# Altium schematic sheet output_driver.SchDoc: Output Drivers
size Letter; Organization: NewAE Technology Inc.; Address1: 1083 Queen St., Suite 196; Address2: Halifax; Address3: NS; Address4: Canada B3H 0B2; SheetApproved: NO
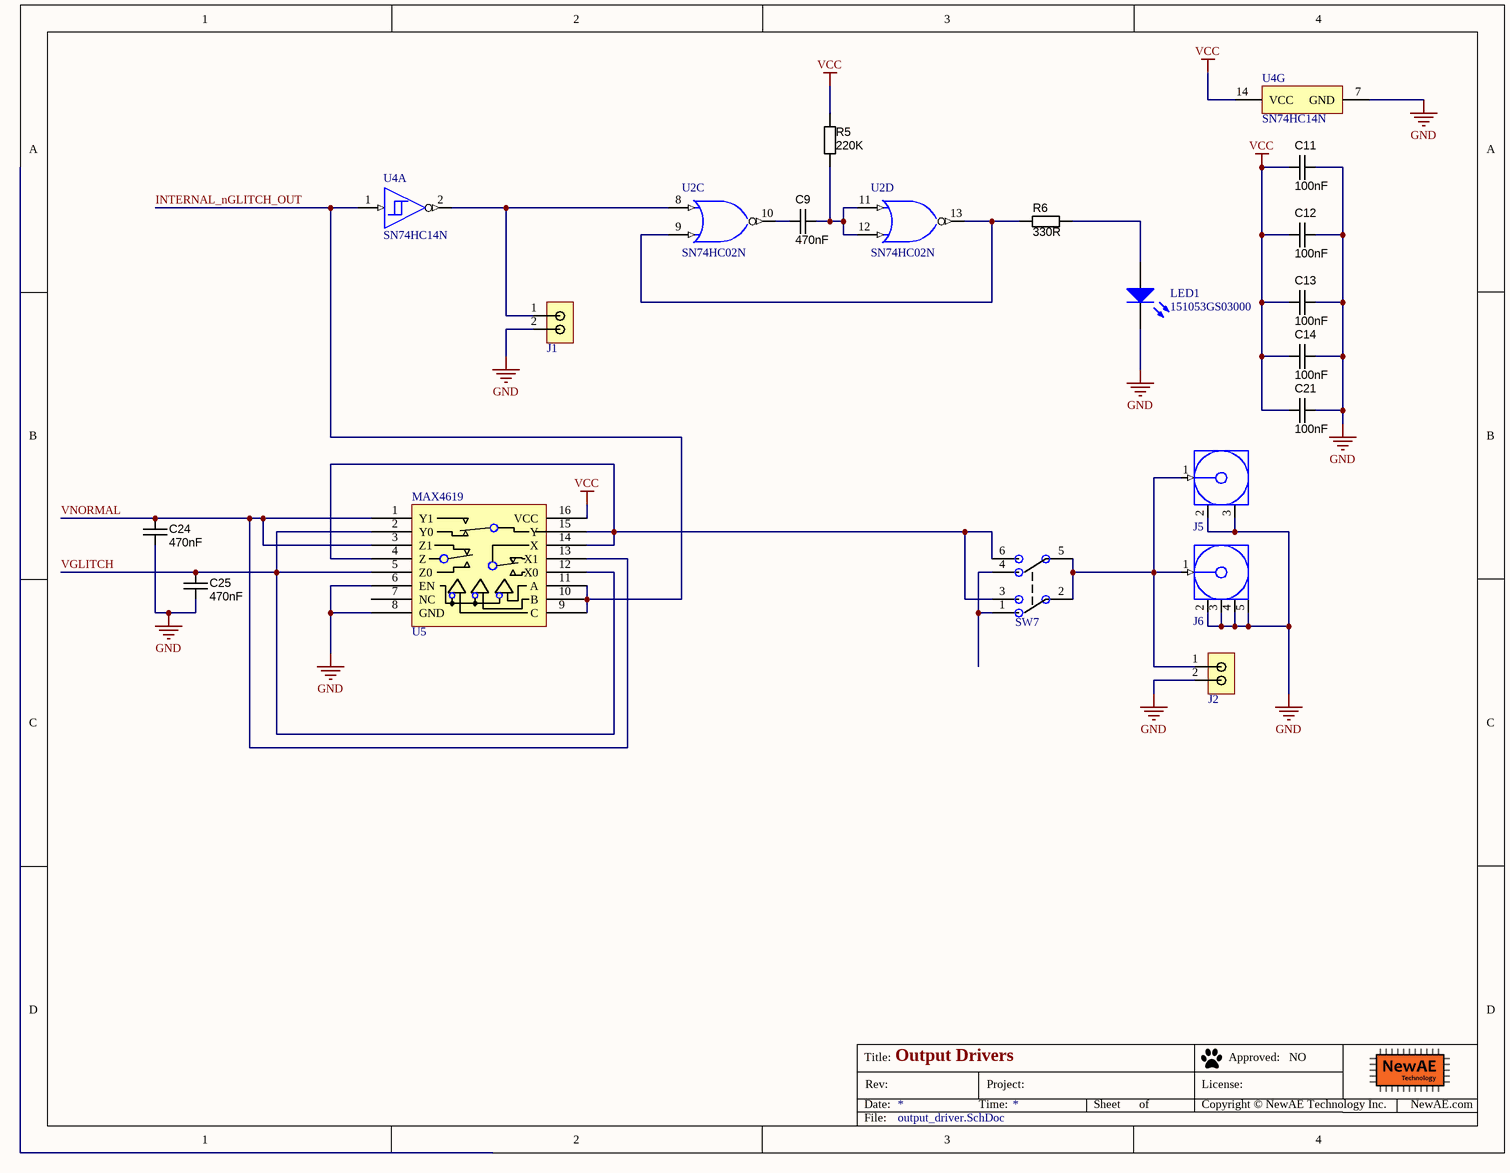
[diagram p0: output_driver.SchDoc]

## Parts
C9  value 470nF  [CAPC500P450250X550]  (hidden comment: approved sub OK)
C11  value 100nF  [CAPC500P450250X550]  (hidden comment: approved sub OK)
C12  value 100nF  [CAPC500P450250X550]  (hidden comment: approved sub OK)
C13  value 100nF  [CAPC500P450250X550]  (hidden comment: approved sub OK)
C14  value 100nF  [CAPC500P450250X550]  (hidden comment: approved sub OK)
C21  value 100nF  [CAPC500P450250X550]  (hidden comment: approved sub OK)
C24  value 470nF  [CAPC500P450250X550]  (hidden comment: approved sub OK)
C25  value 470nF  [CAPC500P450250X550]  (hidden comment: approved sub OK)
J1  Jumper  [2x2.54mm_Header]  (value not drawn)
J2  Jumper  [2x2.54mm_Header]  (value not drawn)
J5  73171-3150  [73171-3150]  (value not drawn)
J6  CON-SMA-PCBEDGE-003.062  [CON-SMAM-PCB-EDGE062]  (value not drawn)
LED1  151053GS03000  [Type 5mm]
R5  value 220K  [RESTH_AXIAL-0.4]  (hidden comment: Carbon Film)
R6  value 330R  [RESTH_AXIAL-0.4]  (hidden comment: Carbon Film)
SW7  EG2207  [EG2207]  (value not drawn)
U2  SN74HC02N  [N0014A]  (parts C,D of 5)
U4  SN74HC14N  [N0014A]  (parts A,G of 7)
U5  MAX4619  [DIP16]

## Nets
GND: C11.1 C12.1 C13.1 C14.1 C21.1 C24.1 C25.1 J1.2 J2.2 J5.2(GND) J5.3(GND) J6.2(GND) J6.3(GND) J6.4(GND) J6.5(GND) LED1.1(K) U4.7(GND) U5.6(EN) U5.8(GND)
VCC: C11.2 C12.2 C13.2 C14.2 C21.2 R5.2 U4.14(VCC) U5.16(VCC)
INTERNAL_nGLITCH_OUT: U4.1(1A) U5.9(C) U5.10(B) U5.11(A)
VGLITCH: C25.2 U5.2(Y0) U5.5(Z0) U5.12(X0)
VNORMAL: C24.2 U5.1(Y1) U5.3(Z1) U5.13(X1)
NetC9_1: C9.1 U2.10(3Y)
NetC9_2: C9.2 R5.1 U2.11(4A) U2.12(4B)
NetJ1_1: J1.1 U2.8(3A) U4.2(~{1Y})
NetJ2_1: J2.1 J5.1(Signal) J6.1(Signal) SW7.2(IN) SW7.5(IN)
NetLED1_2: LED1.2(A) R6.1
NetR6_2: R6.2 U2.9(3B) U2.13(4Y)
NetSW7_1: SW7.1(IN) SW7.4(IN)
NetSW7_3: SW7.3(IN) SW7.6(IN) U5.4(Z) U5.14(X) U5.15(Y)

Not connected (* = marked no-connect by the designer): U5 7(NC)

## Notes on the sheet
- Title:
- Date:
- Rev:
- Time:
- Project:
- Sheet
- of
- License:
- Copyright © NewAE Technology Inc.
- Approved:
- NewAE.com
- File:

## Library data of the parts
C9 C24 C25 = CAPR_220n_Radial_5mm: Capacitor Ceramic 100nF 10% 50V X7R radial 5mm lead spacing; Manufacturer 1: TDK Corporation; Ratings: 50V; X7R; SCDType: spec; Tolerance: ±10%; Material: ceramic; Supplier 1: Digi-Key; Package / Case: 0.217" L x 0.177" W (5.50mm x 4.50mm) radial 5mm LS; Operating Temperature: -55°C ~ 125°C; ComponentLink1URL: http://www.tdk.co.jp/tefe02/e4941_fk.pdf; ComponentLink1Description: e4941_fk datasheet
C11-C14 C21 = CAPR_220n_Radial_5mm: Capacitor Ceramic 220nF 10% 50V X7R radial 5mm lead spacing; Manufacturer 1: TDK Corporation; Ratings: 50V; X7R; SCDType: spec; Tolerance: ±10%; Material: ceramic; Supplier 1: Digi-Key; Package / Case: 0.217" L x 0.177" W (5.50mm x 4.50mm) radial 5mm LS; Operating Temperature: -55°C ~ 125°C; ComponentLink1URL: http://www.tdk.co.jp/tefe02/e4941_fk.pdf; ComponentLink1Description: e4941_fk datasheet
J1 J2 = 2_PIN_JUMPER: 1x2 2.54mm header, male pins; Manufacture 1: Harwin; Manufacture Part Number 1: M20-9990246; Component Group: PCB Feature; PP Material Stack: 0; Part Number: 2_PIN_JUMPER; Pin Count: 2; Supplier 1: Digi-Key; Supplier Part Number 1: 952-2262-ND; Mounting Technology: Through-hole; RoHS: Yes; Component Kind: Standard; Component Type: Standard; PP Rotation: 0
J5 = CON-BNC-CHEAP: Molex Cheap R/A BNC; Component Group: Connector; PP Material Stack: 0; Part Number: CON-BNC-CHEAP; Manufacture 1: Molex; Manufacture Part Number 1: 73171-3150; Pin Count: 3; Supplier 1: Digi-Key; Component Kind: Standard; Component Type: Standard; PP Rotation: 0
J6 = CON-SMA-PCBEDGE-003.062: SMA Female Edge Mount Connector for 0.062" Thick Board; Part Number: CON-SMA-PCBEDGE-003.062; Component Group: Connector; Pin Count: 5; ComponentLink1Description: Manufacturer URL; ComponentLink1URL: http://www.linxtechnologies.com/; ComponentLink2Description: Datasheet; ComponentLink2URL: http://www.connectorcity.com/diagrams/SMA/CONSMA003.062.pdf; Component Kind: Standard; Component Type: Standard
LED1 = CMP-1489-00005-1: THT LED round mono-color waterclear, WL-TMRW, Green; Manufacturer: Wuerth Elektronik; ComponentLink2URL: http://katalog.we-online.de/pbs/datasheet/7448042001.pdfhttp://katalog.we-online.de/pbs/datasheet/7448042001.pdfhttp://katalog.we-online.de/pbs/datasheet/7448042001.pdfhttp://katalog.we-online.de/pbs/datasheet/151053GS03000.pdf; ComponentLink2Description: Datasheet; ComponentLink1URL: http://www.we-online.com; PackageReference: Type 5mm; ComponentLink1Description: Manufacturer URL; PartNumber: 151053GS03000; Emitting color: Green
R5 R6 = RES_220R_Axial_0.25W_5%: Resistor THD Axial 10K Ohm 0.25W 5% Carbon Film; Manufacturer 1: Yageo; Manufacturer Part Number 1: CFR-25JB-220R; Ratings: 1/4W; SCDType: spec; Tolerance: ±5%; Package / Case: Axial; Supplier 1: Digi-Key; Supplier Part Number 1: 220QBK-ND
SW7 = EG2207: DPDT Switch with 2 MH; Manufacture 1: E-Switch; PP Material Stack: 0; Part Number: EG2207; Component Group: Switch; Manufacture Part Number 1: EG2207; Pin Count: 8; Supplier 1: Digi-Key; Supplier Part Number 1: EG1940-ND; Mounting Technology: Through-hole; RoHS: Yes; Component Kind: Standard; Component Type: Standard; PP Rotation: 0
U2 = CMP-0806-00198-3: Quadruple 2-Input Positive-NOR Gates, N0014A, TUBE; Manufacturer: Texas Instruments; F @ Nom Voltage(Max)(Mhz): 70; Rating: Catalog; Input Type: CMOS; Voltage(Nom)(V): 5; VCC(Min)(V): 2; Output Drive (IOL/IOH)(Max)(mA): 4/-4; ICC @ Nom Voltage(Max)(mA): 0.02; VCC(Max)(V): 6; Bits(#): 4; tpd @ Nom Voltage(Max)(ns): 23; Operating Temperature Range(C): -40 to 85; PackageVersion: http://www.ti.com/lit/ml/mpdi002c/mpdi002c.pdf; Generic Part Number: SN74HC02; Output Type: CMOS; Code_JEDEC: MS-001; DatasheetVersion: SCLS076E; PackageReference: N0014A
U4 = CMP-1615-00889-3: Hex Schmitt-Trigger Inverters, N0014A, TUBE; Manufacturer: Texas Instruments; Input Type: CMOS; Voltage(Nom)(V): 5; VCC(Min)(V): 2; tpd @ Nom Voltage(Max)(ns): 31; Technology Family: HC; VCC(Max)(V): 6; F @ Nom Voltage(Max)(Mhz): 20; Output Drive (IOL/IOH)(Max)(mA): -4/4; Rating: Catalog; Schmitt Trigger: Yes; ICC @ Nom Voltage(Max)(mA): 0.02; PackageReference: N0014A; Code_JEDEC: MS-001; Operating Temperature Range(C): -40 to 85; Generic Part Number: SN74HC14; Bits(#): 6; DatasheetVersion: SCLS085G; Output Type: CMOS
U5 = MAX4619: Analog Mux; Manufacture 1: Maxim; Component Group: Analog IC; PP Material Stack: 0; Part Number: MAX4619; Manufacture Part Number 1: MAX4619; Pin Count: 16; Component Kind: Standard; Component Type: Standard; PP Rotation: 0